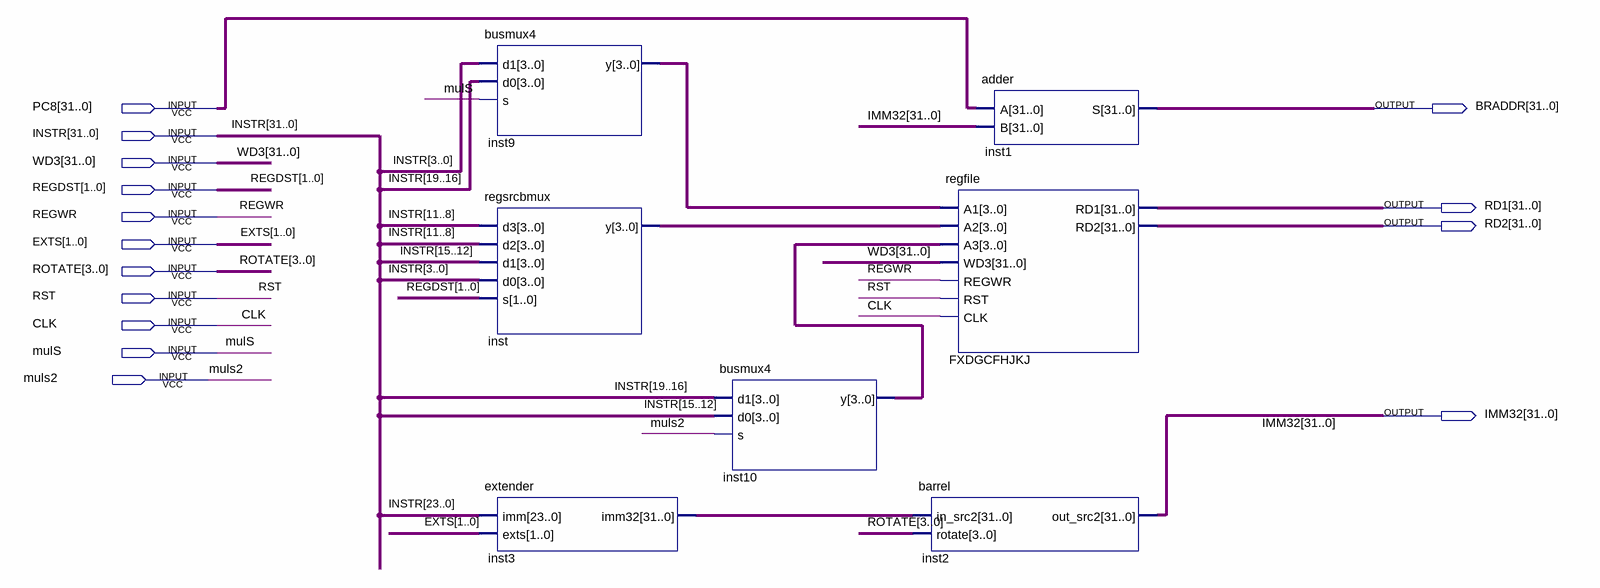
[diagram p0: schematic sheet]
// Quartus schematic decode.bdf as structural Verilog: 7 symbols, 15 pins
module decode (
  input  [31:0] PC8,
  input  [31:0] INSTR,
  input  [31:0] WD3,
  input  [1:0] REGDST,
  input  REGWR,
  input  [1:0] EXTS,
  input  [3:0] ROTATE,
  input  RST,
  input  CLK,
  input  mulS,
  input  muls2,
  output [31:0] BRADDR,
  output [31:0] RD1,
  output [31:0] RD2,
  output [31:0] IMM32
);

  wire [3:0] inst9_y, inst10_y, inst_y;
  wire [31:0] inst3_imm32;

  busmux4 inst9 (.d1(INSTR[3:0]), .d0(INSTR[19:16]), .s(mulS), .y(inst9_y));
  regsrcbmux inst (.d3(INSTR[11:8]), .d2(INSTR[11:8]), .d1(INSTR[15:12]), .d0(INSTR[3:0]), .s(REGDST), .y(inst_y));
  extender inst3 (.imm(INSTR[23:0]), .exts(EXTS), .imm32(inst3_imm32));
  busmux4 inst10 (.d1(INSTR[19:16]), .d0(INSTR[15:12]), .s(muls2), .y(inst10_y));
  adder inst1 (.A(PC8), .B(IMM32), .S(BRADDR));
  regfile FXDGCFHJKJ (
    .A1(inst9_y), .A2(inst_y), .A3(inst10_y), .WD3(WD3), .REGWR(REGWR), .RST(RST), .CLK(CLK), .RD1(RD1),
    .RD2(RD2));
  barrel inst2 (.in_src2(inst3_imm32), .rotate(ROTATE), .out_src2(IMM32));
endmodule
